# Altium schematic sheet 2.SchDoc
size A3
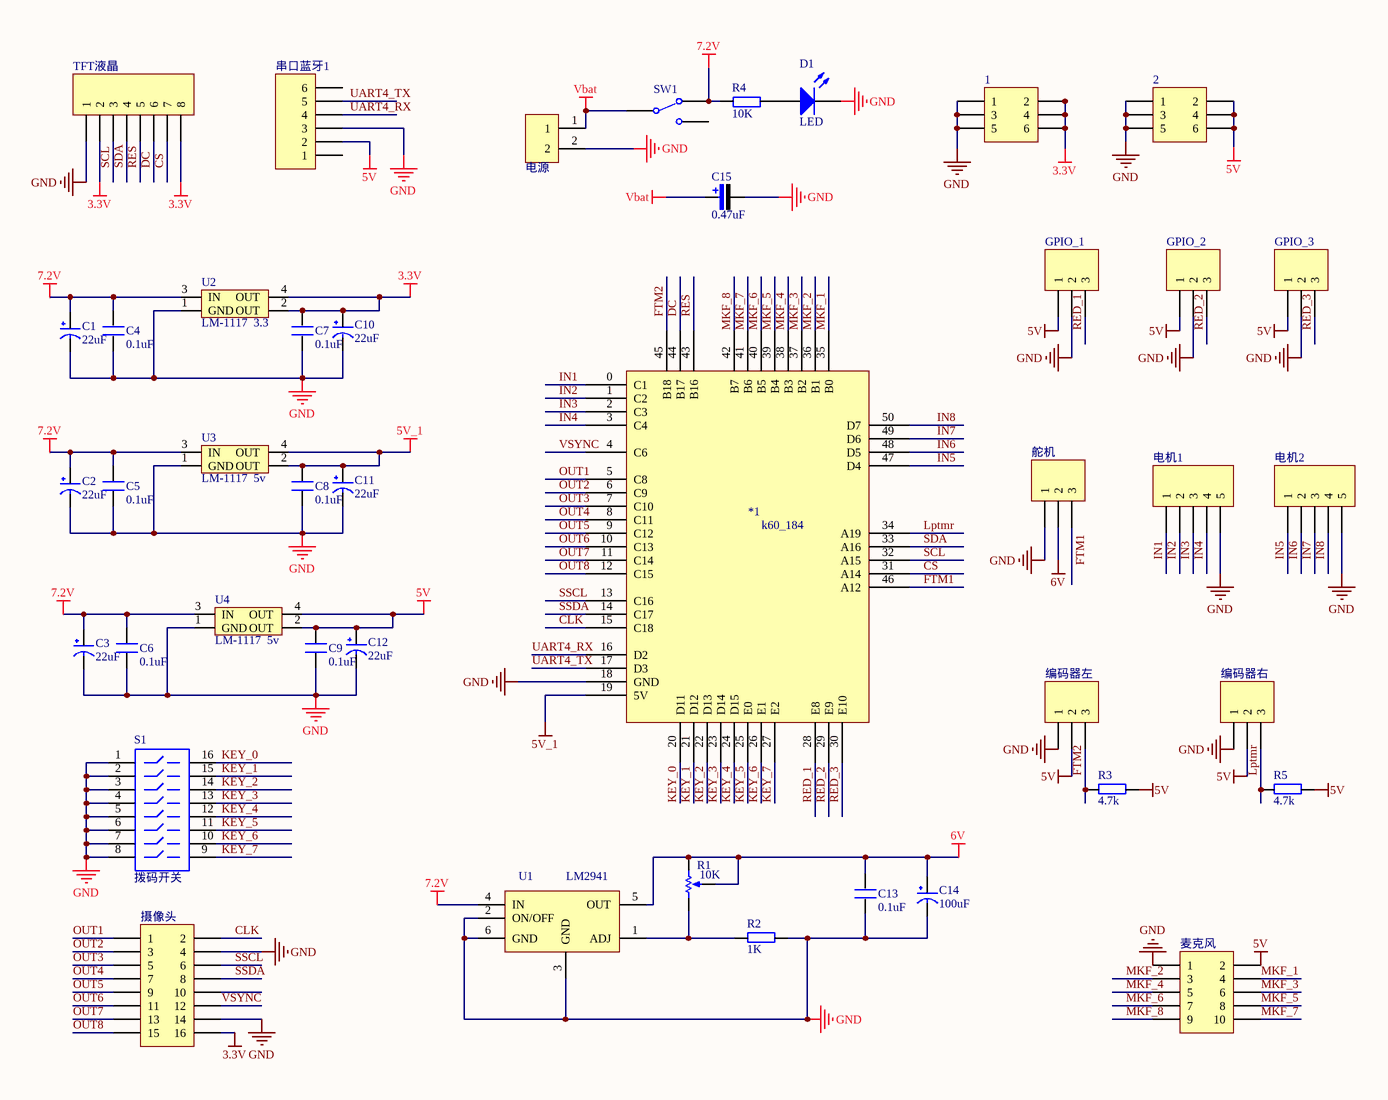
[diagram p0: 2.SchDoc]

## Parts
1  Header 3X2  [HDR2X3]  (value not drawn)
2  Header 3X2  [HDR2X3]  (value not drawn)
*1  k60_184  [k60_184]
C1  22uF  [0603]
C2  22uF  [0603]
C3  22uF  [0603]
C4  0.1uF  [0603]
C5  0.1uF  [0603]
C6  0.1uF  [0603]
C7  0.1uF  [0603]
C8  0.1uF  [0603]
C9  0.1uF  [0603]
C10  22uF  [0603]
C11  22uF  [0603]
C12  22uF  [0603]
C13  0.1uF  [0603]
C14  100uF  [1206钽]
C15  value 0.47uF  [CAP-3528]  (hidden comment: Cap Pol)
D1  LED  [LED2]
GPIO_1  GPIO  [HDR1X3]  (value not drawn)
GPIO_2  GPIO  [HDR1X3]  (value not drawn)
GPIO_3  GPIO  [HDR1X3]  (value not drawn)
R1  value 10K  [VR_B1]  (hidden comment: RPot)
R2  1K  [0603]
R3  4.7k  [0603]
R4  10K  [0603]
R5  4.7k  [0603]
S1  拨码开关  [DIP16-KEY]
SW1  SW-纽子  [SW-纽子]  (value not drawn)
TFT液晶  TFT液晶  [HDR1X8]  (value not drawn)
U1  LM2941  [LM2941]
U2  LM-1117  3.3  [SOT220P700X180-4N]
U3  LM-1117  5v  [SOT220P700X180-4N]
U4  LM-1117  5v  [SOT220P700X180-4N]
串口蓝牙1  Header 6  [HDR1X6]  (value not drawn)
摄像头  Header 8X2  [HDR2X8]  (value not drawn)
电机1  电机  [HDR1X5]  (value not drawn)
电机2  电机  [HDR1X5]  (value not drawn)
电源  电机  [接线端子]  (value not drawn)
编码器右  Header 3  [HDR1X3]  (value not drawn)
编码器左  Header 3  [HDR1X3]  (value not drawn)
舵机  Header 3  [HDR1X3]  (value not drawn)
麦克风  Header 5X2  [HDR2X5]  (value not drawn)

## Nets
3.3V: 1.2 1.4 1.6 C7.2 C10.1(VCC) TFT液晶.2 TFT液晶.8 U2.2(OUT) U2.4(OUT) 摄像头.16
5V: 2.2 2.4 2.6 C9.2 C12.1(VCC) GPIO_1.1 GPIO_2.1 GPIO_3.1 R3.1 R5.1 U4.2(OUT) U4.4(OUT) 串口蓝牙1.2 编码器右.2 编码器左.2 麦克风.2
5V_1: *1.19(5V) C8.2 C11.1(VCC) U3.2(OUT) U3.4(OUT)
6V: C13.2 C14.1(VCC) R1.2(TAP) R1.3(BOT) U1.5(OUT) 舵机.2
7.2V: C1.1(VCC) C2.1(VCC) C3.1(VCC) C4.2 C5.2 C6.2 R4.1 SW1.1(NO) U1.4(IN) U2.3(IN) U3.3(IN) U4.3(IN)
GND: 1.1 1.3 1.5 2.1 2.3 2.5 *1.18(GND) C1.2(GND) C2.2(GND) C3.2(GND) C4.1 C5.1 C6.1 C7.1 C8.1 C9.1 C10.2(GND) C11.2(GND) C12.2(GND) C13.1 C14.2(GND) C15.2 D1.2(K) GPIO_1.2 GPIO_2.2 GPIO_3.2 R2.1 S1.1 S1.2 S1.3 S1.4 S1.5 S1.6 S1.7 S1.8 TFT液晶.1 U1.2(ON/OFF) U1.3(GND) U1.6(GND) U2.1(GND) U3.1(GND) U4.1(GND) 串口蓝牙1.3 摄像头.4 摄像头.14 电机1.5 电机2.5 电源.2 编码器右.1 编码器左.1 舵机.1 麦克风.1
Vbat: C15.1 SW1.2(COMMON) 电源.1
CLK: *1.15(C18) 摄像头.2
CS: *1.31(A14) TFT液晶.7
DC: *1.44(B17) TFT液晶.6
FTM1: *1.46(A12) 舵机.3
FTM2: *1.45(B18) R3.2 编码器左.3
IN1: *1.0(C1) 电机1.1
IN2: *1.1(C2) 电机1.2
IN3: *1.2(C3) 电机1.3
IN4: *1.3(C4) 电机1.4
IN5: *1.47(D4) 电机2.1
IN6: *1.48(D5) 电机2.2
IN7: *1.49(D6) 电机2.3
IN8: *1.50(D7) 电机2.4
KEY_0: *1.20(D11) S1.16
KEY_1: *1.21(D12) S1.15
KEY_2: *1.22(D13) S1.14
KEY_3: *1.23(D14) S1.13
KEY_4: *1.24(D15) S1.12
KEY_5: *1.25(E0) S1.11
KEY_6: *1.26(E1) S1.10
KEY_7: *1.27(E2) S1.9
Lptmr: *1.34(A19) R5.2 编码器右.3
MKF_1: *1.35(B0) 麦克风.4
MKF_2: *1.36(B1) 麦克风.3
MKF_3: *1.37(B2) 麦克风.6
MKF_4: *1.38(B3) 麦克风.5
MKF_5: *1.39(B4) 麦克风.8
MKF_6: *1.40(B5) 麦克风.7
MKF_7: *1.41(B6) 麦克风.10
MKF_8: *1.42(B7) 麦克风.9
OUT1: *1.5(C8) 摄像头.1
OUT2: *1.6(C9) 摄像头.3
OUT3: *1.7(C10) 摄像头.5
OUT4: *1.8(C11) 摄像头.7
OUT5: *1.9(C12) 摄像头.9
OUT6: *1.10(C13) 摄像头.11
OUT7: *1.11(C14) 摄像头.13
OUT8: *1.12(C15) 摄像头.15
RED_1: *1.28(E8) GPIO_1.3
RED_2: *1.29(E9) GPIO_2.3
RED_3: *1.30(E10) GPIO_3.3
RES: *1.43(B16) TFT液晶.5
SCL: *1.32(A15) TFT液晶.3
SDA: *1.33(A16) TFT液晶.4
SSCL: *1.13(C16) 摄像头.6
SSDA: *1.14(C17) 摄像头.8
UART4_RX: *1.16(D2) 串口蓝牙1.4
UART4_TX: *1.17(D3) 串口蓝牙1.5
VSYNC: *1.4(C6) 摄像头.12
NetD1_1: D1.1(A) R4.2
NetR1_1: R1.1(TOP) R2.2 U1.1(ADJ)

Not connected (* = marked no-connect by the designer): SW1 3(OFF); 串口蓝牙1 1 6; 摄像头 10

## Library data of the parts
1 2 = Header 3X2: Header, 3-Pin, Dual row; LatestRevisionDate: 17-Jul-2002; LatestRevisionNote: Re-released for DXP Platform.; Publisher: Altium Limited
C1-C3 C10-C12 C14 = Cap+
C4-C9 C13 = Cap
C15 = Cap Pol: 极性电解电容; Vol: 16V; Published: 8-Jun-2000; LatestRevisionDate: 17-Jul-2002; LatestRevisionNote: Re-released for DXP Platform.; PackageReference: RB7.6-15; Publisher: Altium Limited
GPIO_1-GPIO_3 编码器右 编码器左 舵机 = Header 3: Header, 3-Pin; LatestRevisionDate: 17-Jul-2002; LatestRevisionNote: Re-released for DXP Platform.; Publisher: Altium Limited
R1 = RPot: 精密可调电阻; Sim Note: Enter the Resistance value and the set point into parameter fields.; Set Position: 0.5; Published: 8-Jun-2000; LatestRevisionDate: 17-Jul-2002; LatestRevisionNote: Re-released for DXP Platform.; PackageReference: VR5; Publisher: Altium Limited
R2-R5 = R
S1 = SW-DIP8: 8位直插拨码开关; Published: 24-Mar-1999; LatestRevisionDate: 17-Dec-2003; LatestRevisionNote: PCB Footprint replaced.; PackageReference: DIP-16-KEY; Publisher: Altium Limited; ComponentLink1Description: Manufacturer Link; ComponentLink1URL: http://www.oupiin.com/prodindx.html#Headers
TFT液晶 = Header 8: Header, 8-Pin; LatestRevisionDate: 17-Jul-2002; LatestRevisionNote: Re-released for DXP Platform.; Publisher: Altium Limited
U2-U4 = AMS-1117
串口蓝牙1 = Header 6: Header, 6-Pin; LatestRevisionDate: 17-Jul-2002; LatestRevisionNote: Re-released for DXP Platform.; Publisher: Altium Limited
摄像头 = Header 8X2: Header, 8-Pin, Dual row; LatestRevisionDate: 17-Jul-2002; LatestRevisionNote: Re-released for DXP Platform.; Publisher: Altium Limited
电机1 电机2 = Header 5: Header, 5-Pin; LatestRevisionDate: 17-Jul-2002; LatestRevisionNote: Re-released for DXP Platform.; Publisher: Altium Limited
电源 = 接线端子
麦克风 = Header 5X2: Header, 5-Pin, Dual row; LatestRevisionDate: 17-Jul-2002; LatestRevisionNote: Re-released for DXP Platform.; Publisher: Altium Limited